# Altium schematic sheet power_unit.SchDoc
size 594 x 420 mm; Language: en; ResponsibleDept: DED; DocumentStatus: Released; DecimalNumber: {DecimalNumber}; ApprovedBy: Мельников; CheckedBy: Соколов; CompanyName: Диаконт; DrawnBy: Тихонов; DocumentNumber: ЭИТЦЯ.435131.005 Э3; SheetTotal: 1; Title0: Модуль силовой РМ; DocumentType: Схема электрическая принципиальная; Liter: Э; PageSetup: Record=PageOptions|CenterHorizontal=True|CenterVertical=True|PrintScale=0.96|XCorrection=1.00|YCorrection=1.00|PrintKind=1|BorderSize=5000000|LeftOffset=0|BottomOffset=0|Orientation=2|PaperLength=1000|PaperWidth=1000|Scale=100|PaperSource=7|PrintQuality=-4|MediaType=1|DitherType=10|PaperKind=A3|PrintScaleMode=1; FirstApp: ИТЦЯ.435131.005
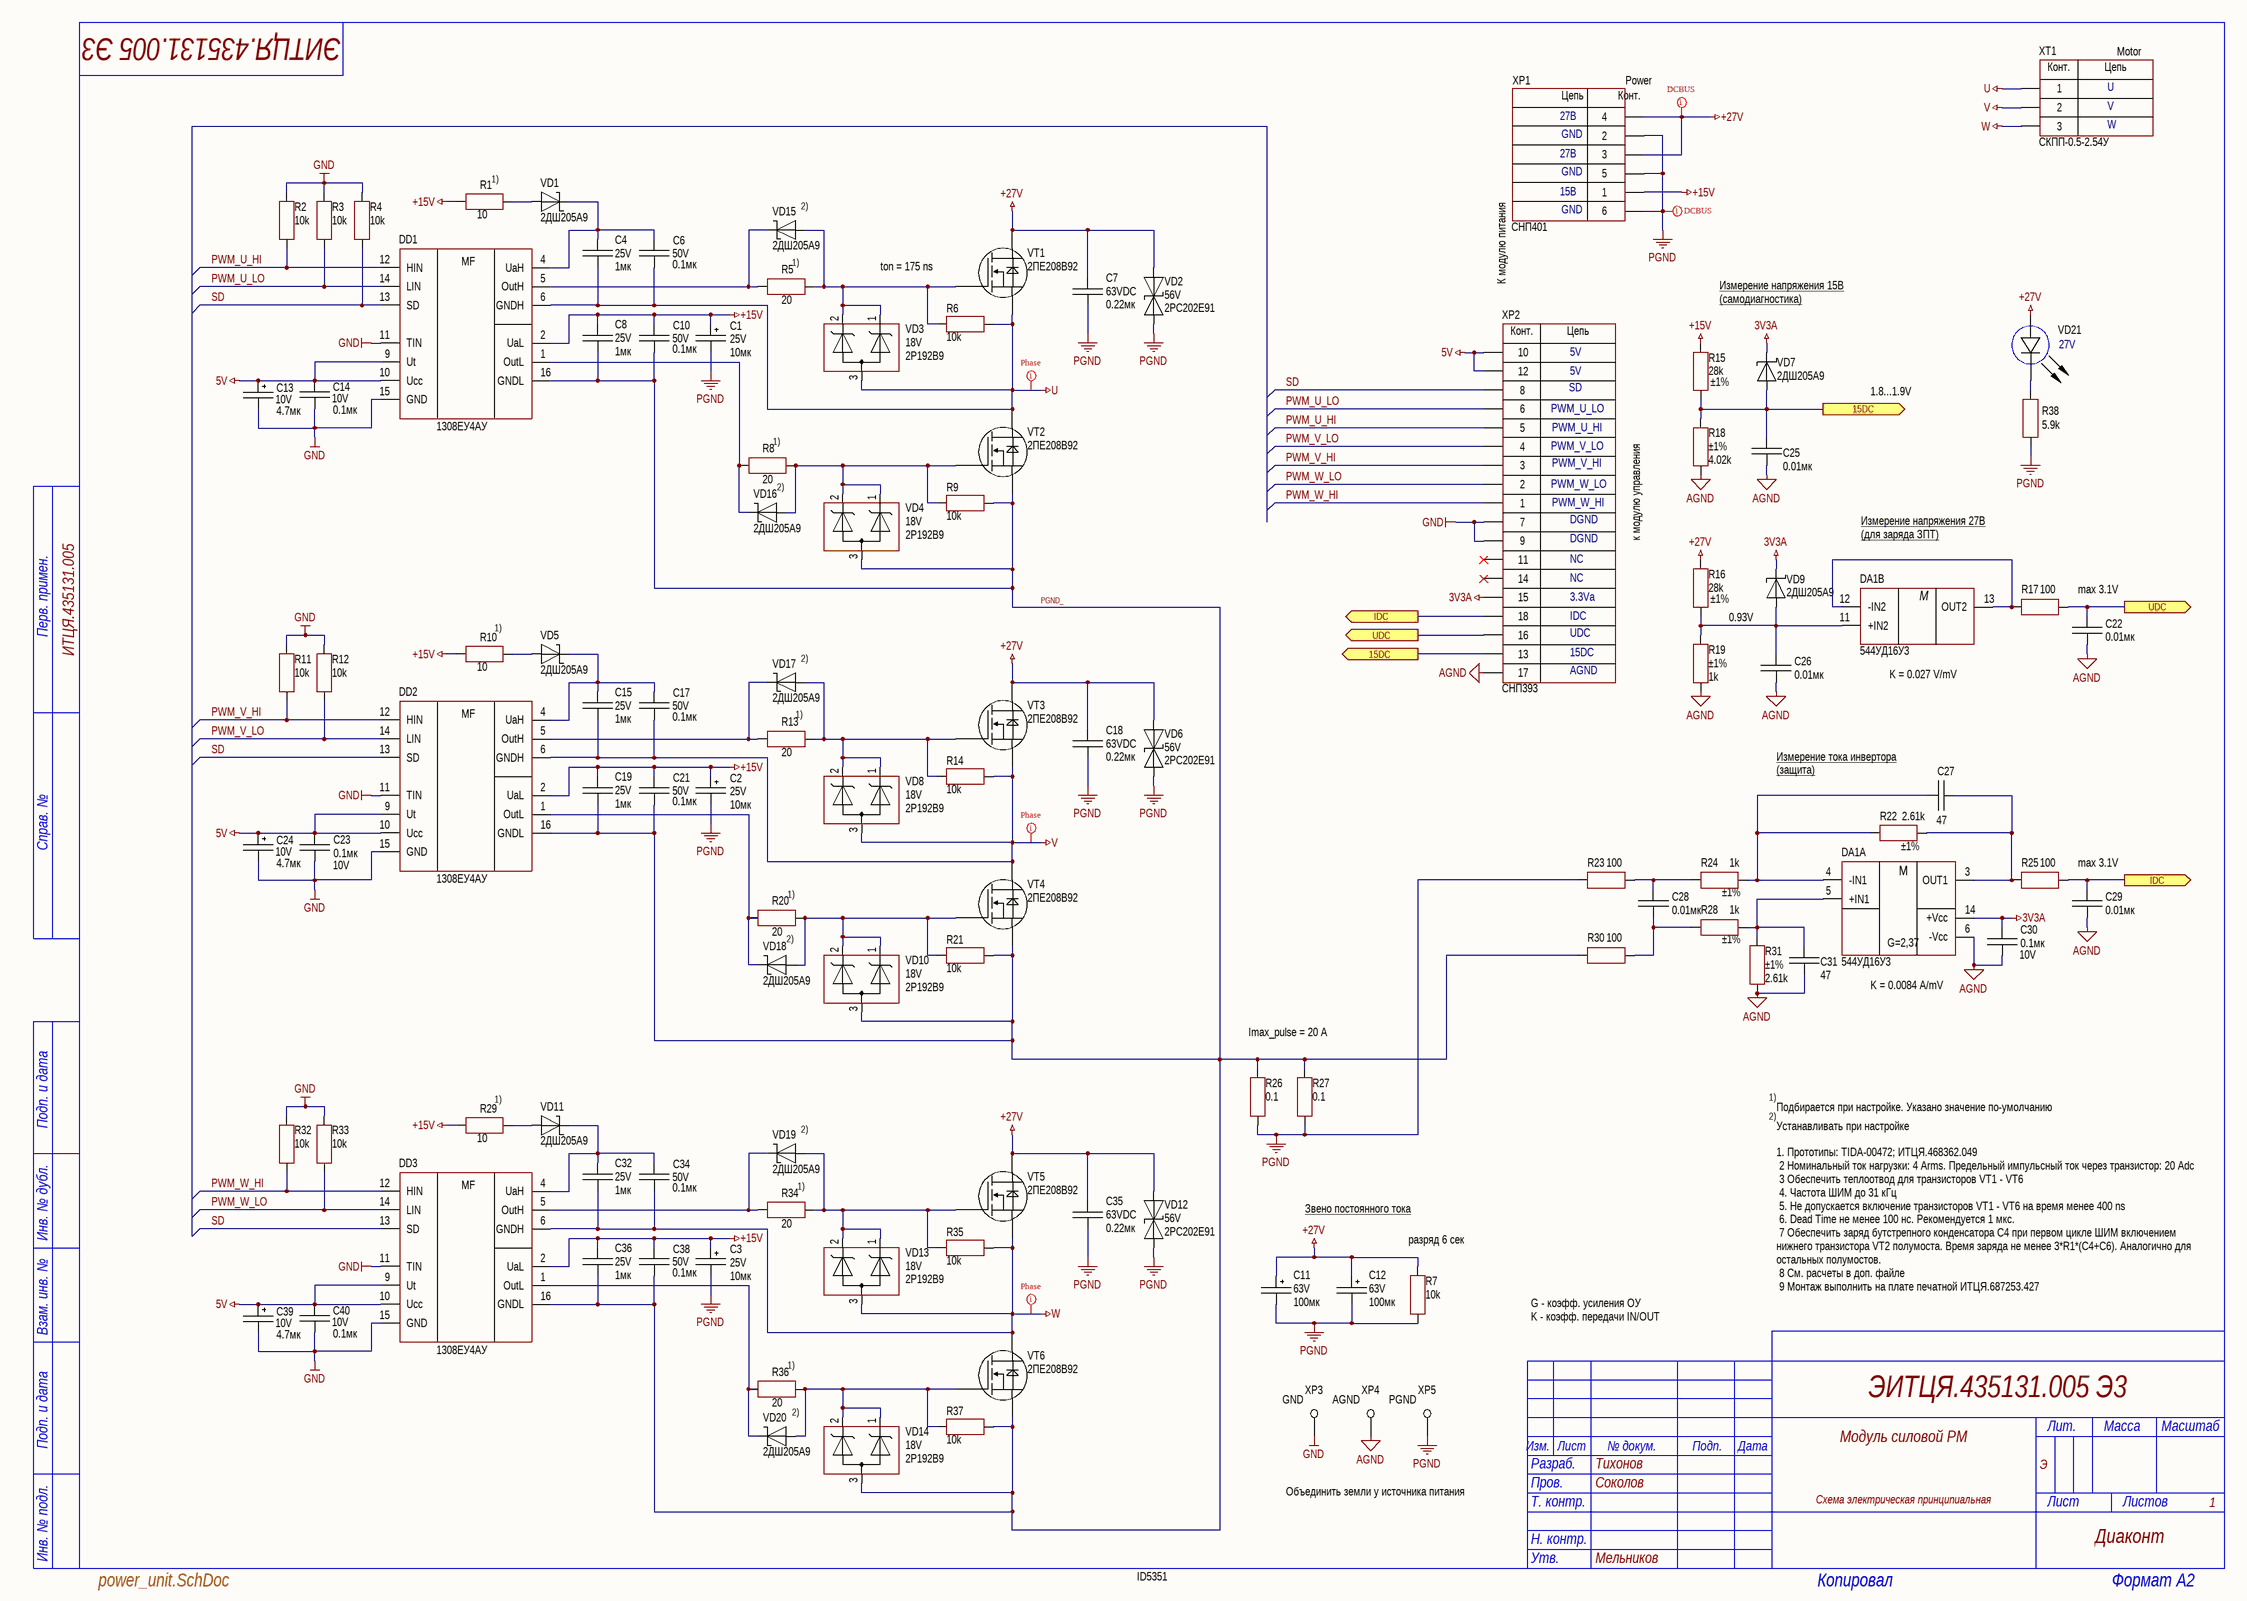
[diagram p0: power_unit.SchDoc]

## Parts
C1  value 10мк  Voltage: 25V  [CAP: TANTAL-C]
C2  value 10мк  Voltage: 25V  [CAP: TANTAL-C]
C3  value 10мк  Voltage: 25V  [CAP: TANTAL-C]
C4  value 1мк  Voltage: 25V  [CAP: 1210]
C6  value 0.1мк  Voltage: 50V  [CAP: 0805P]
C7  value 0.22мк  Voltage: 63VDC  [CAP: K73-17 12x10x6]
C8  value 1мк  Voltage: 25V  [CAP: 1210]
C10  value 0.1мк  Voltage: 50V  [CAP: 0805P]
C11  value 100мк  Voltage: 63V  [CAP: D8C3.5H12]
C12  value 100мк  Voltage: 63V  [CAP: D8C3.5H12]
C13  value 4.7мк  Voltage: 10V  [CAP: TANTAL-A]
C14  value 0.1мк  Voltage: 10V  [CAP: 0603P]
C15  value 1мк  Voltage: 25V  [CAP: 1210]
C17  value 0.1мк  Voltage: 50V  [CAP: 0805P]
C18  value 0.22мк  Voltage: 63VDC  [CAP: K73-17 12x10x6]
C19  value 1мк  Voltage: 25V  [CAP: 1210]
C21  value 0.1мк  Voltage: 50V  [CAP: 0805P]
C22  value 0.01мк  [CAP: 0603P]
C23  value 0.1мк  Voltage: 10V  [CAP: 0603P]
C24  value 4.7мк  Voltage: 10V  [CAP: TANTAL-A]
C25  value 0.01мк  [CAP: 0603P]
C26  value 0.01мк  [CAP: 0603P]
C27  value 47  [CAP: 0603P]
C28  value 0.01мк  [CAP: 0603P]
C29  value 0.01мк  [CAP: 0603P]
C30  value 0.1мк  Voltage: 10V  [CAP: 0603P]
C31  value 47  [CAP: 0603P]
C32  value 1мк  Voltage: 25V  [CAP: 1210]
C34  value 0.1мк  Voltage: 50V  [CAP: 0805P]
C35  value 0.22мк  Voltage: 63VDC  [CAP: K73-17 12x10x6]
C36  value 1мк  Voltage: 25V  [CAP: 1210]
C38  value 0.1мк  Voltage: 50V  [CAP: 0805P]
C39  value 4.7мк  Voltage: 10V  [CAP: TANTAL-A]
C40  value 0.1мк  Voltage: 10V  [CAP: 0603P]
DA1  Part_Number: 544УД16У3  [16-Н04.16-1B]  (hidden comment: 544УД16У3 (Н04.16-1В) АЕЯР.431130.510 ТУ_разнесенная 1)  (parts A,B of 2)
DD1  PartNumber: 1308ЕУ4АУ  [16-Н04.16-1B]
DD2  PartNumber: 1308ЕУ4АУ  [16-Н04.16-1B]
DD3  PartNumber: 1308ЕУ4АУ  [16-Н04.16-1B]
R1  value 10  [RES: 0603P]
R2  value 10k  [RES: 0603P]
R3  value 10k  [RES: 0603P]
R4  value 10k  [RES: 0603P]
R5  value 20  [RES: 0805P]
R6  value 10k  [RES: 0603P]
R7  value 10k  [RES: 0805P]
R8  value 20  [RES: 0805P]
R9  value 10k  [RES: 0603P]
R10  value 10  [RES: 0603P]
R11  value 10k  [RES: 0603P]
R12  value 10k  [RES: 0603P]
R13  value 20  [RES: 0805P]
R14  value 10k  [RES: 0603P]
R15  value 28k  Tolerance: ±1%  [RES: 0603P]
R16  value 28k  Tolerance: ±1%  [RES: 0603P]
R17  value 100  [RES: 0603P]
R18  value 4.02k  Tolerance: ±1%  [RES: 0603P]
R19  value 1k  Tolerance: ±1%  [RES: 0603P]
R20  value 20  [RES: 0805P]
R21  value 10k  [RES: 0603P]
R22  value 2.61k  Tolerance: ±1%  [RES: 0603P]
R23  value 100  [RES: 0603P]
R24  value 1k  Tolerance: ±1%  [RES: 0603P]
R25  value 100  [RES: 0603P]
R26  value 0.1  [RES: 2512]
R27  value 0.1  [RES: 2512]
R28  value 1k  Tolerance: ±1%  [RES: 0603P]
R29  value 10  [RES: 0603P]
R30  value 100  [RES: 0603P]
R31  value 2.61k  Tolerance: ±1%  [RES: 0603P]
R32  value 10k  [RES: 0603P]
R33  value 10k  [RES: 0603P]
R34  value 20  [RES: 0805P]
R35  value 10k  [RES: 0603P]
R36  value 20  [RES: 0805P]
R37  value 10k  [RES: 0603P]
R38  value 5.9k  [RES: 0805P]
VD1  PartNumber: 2ДШ205А9  [SOT23]
VD2  Voltage: 56V  PartNumber: 2РС202Е91  [DIODE: SMB]
VD3  Voltage: 18V  PartNumber: 2Р192В9  [SOT23]
VD4  Voltage: 18V  PartNumber: 2Р192В9  [SOT23]
VD5  PartNumber: 2ДШ205А9  [SOT23]
VD6  Voltage: 56V  PartNumber: 2РС202Е91  [DIODE: SMB]
VD7  PartNumber: 2ДШ205А9  [SOT23]
VD8  Voltage: 18V  PartNumber: 2Р192В9  [SOT23]
VD9  PartNumber: 2ДШ205А9  [SOT23]
VD10  Voltage: 18V  PartNumber: 2Р192В9  [SOT23]
VD11  PartNumber: 2ДШ205А9  [SOT23]
VD12  Voltage: 56V  PartNumber: 2РС202Е91  [DIODE: SMB]
VD13  Voltage: 18V  PartNumber: 2Р192В9  [SOT23]
VD14  Voltage: 18V  PartNumber: 2Р192В9  [SOT23]
VD15  PartNumber: 2ДШ205А9  [SOT23]
VD16  PartNumber: 2ДШ205А9  [SOT23]
VD17  PartNumber: 2ДШ205А9  [SOT23]
VD18  PartNumber: 2ДШ205А9  [SOT23]
VD19  PartNumber: 2ДШ205А9  [SOT23]
VD20  PartNumber: 2ДШ205А9  [SOT23]
VD21  CommentText: 27V  [LED: 0603G]
VT1  PartNumber: 2ПЕ208В92  [DPAK]
VT2  PartNumber: 2ПЕ208В92  [DPAK]
VT3  PartNumber: 2ПЕ208В92  [DPAK]
VT4  PartNumber: 2ПЕ208В92  [DPAK]
VT5  PartNumber: 2ПЕ208В92  [DPAK]
VT6  PartNumber: 2ПЕ208В92  [DPAK]
XP1  CommentText: СНП401  [CON: M80-5000605]  (hidden comment: Power)
XP2  CommentText: СНП393  [CON: PLD-18R]
XP3  AGND  [CON: PLS2-1]  (value not drawn)
XP4  AGND  [CON: PLS2-1]  (value not drawn)
XP5  AGND  [CON: PLS2-1]  (value not drawn)
XT1  CommentText: СКПП-0.5-2.54У  [CON: 233-403 WAGO]

## Ports
15DC (out), IDC (out), UDC (out)

## Nets
3V3A: C30.2 DA1.14(+Vcc) VD7.3(K) VD9.3(K) XP2.15
5V: C13.1 C14.2 C23.2 C24.1 C39.1 C40.2 DD1.9(Ut) DD1.10(Ucc) DD2.9(Ut) DD2.10(Ucc) DD3.9(Ut) DD3.10(Ucc) XP2.10 XP2.12
+15V: C1.1 C2.1 C3.1 C8.2 C10.2 C19.2 C21.2 C36.2 C38.2 DD1.2(UaL) DD2.2(UaL) DD3.2(UaL) R1.1 R10.1 R15.2 R29.1 XP1.1
+27V: C7.1 C11.1 C12.1 C18.1 C35.1 R7.2 R16.2 VD2.2(C) VD6.2(C) VD12.2(C) VD21.1(A) VT1.3(D) VT3.3(D) VT5.3(D) XP1.3 XP1.4
AGND: C22.2 C25.2 C26.2 C29.2 C30.1 C31.2 DA1.6(-Vcc) R18.1 R19.1 R31.1 XP2.17 XP4.1
GND: C13.2 C14.1 C23.1 C24.2 C39.2 C40.1 DD1.11(TIN) DD1.15(GND) DD2.11(TIN) DD2.15(GND) DD3.11(TIN) DD3.15(GND) R2.2 R3.2 R4.2 R11.2 R12.2 R32.2 R33.2 XP2.7 XP2.9 XP3.1
PGND: C1.2 C2.2 C3.2 C7.2 C11.2 C12.2 C18.2 C35.2 R7.1 R23.1 R26.2 R27.2 R38.1 VD2.1(A) VD6.1(A) VD12.1(A) XP1.2 XP1.5 XP1.6 XP5.1
U: C4.1 C6.1 DD1.6(GNDH) R6.1 VD3.3(A) VT1.2(S) VT2.3(D) XT1.1
V: C15.1 C17.1 DD2.6(GNDH) R14.1 VD8.3(A) VT3.2(S) VT4.3(D) XT1.2
W: C32.1 C34.1 DD3.6(GNDH) R35.1 VD13.3(A) VT5.2(S) VT6.3(D) XT1.3
15DC: C25.1 R15.1 R18.2 VD7.1(A) XP2.13 ; port 15DC
IDC: C29.1 R25.2 XP2.18 ; port IDC
PGND_: C8.1 C10.1 C19.1 C21.1 C36.1 C38.1 DD1.16(GNDL) DD2.16(GNDL) DD3.16(GNDL) R9.1 R21.1 R26.1 R27.1 R30.1 R37.1 VD4.3(A) VD10.3(A) VD14.3(A) VT2.2(S) VT4.2(S) VT6.2(S)
PWM_U_HI: DD1.12(HIN) R2.1 XP2.5
PWM_U_LO: DD1.14(LIN) R3.1 XP2.6
PWM_V_HI: DD2.12(HIN) R11.1 XP2.3
PWM_V_LO: DD2.14(LIN) R12.1 XP2.4
PWM_W_HI: DD3.12(HIN) R32.1 XP2.1
PWM_W_LO: DD3.14(LIN) R33.1 XP2.2
SD: DD1.13(SD) DD2.13(SD) DD3.13(SD) R4.1 XP2.8
UDC: C22.1 R17.2 XP2.16 ; port UDC
NetC4_2: C4.2 C6.2 DD1.4(UaH) VD1.3(K)
NetC15_2: C15.2 C17.2 DD2.4(UaH) VD5.3(K)
NetC26_1: C26.1 DA1.11(+IN2) R16.1 R19.2 VD9.1(A)
NetC27_1: C27.1 DA1.3(OUT1) R22.2 R25.1
NetC27_2: C27.2 DA1.4(-IN1) R22.1 R24.2
NetC28_1: C28.1 R23.2 R24.1
NetC28_2: C28.2 R28.1 R30.2
NetC31_1: C31.1 DA1.5(+IN1) R28.2 R31.2
NetC32_2: C32.2 C34.2 DD3.4(UaH) VD11.3(K)
NetDA1_12: DA1.12(-IN2) DA1.13(OUT2) R17.1
NetDD1_1: DD1.1(OutL) R8.1 VD16.3(K)
NetDD1_5: DD1.5(OutH) R5.1 VD15.3(K)
NetDD2_1: DD2.1(OutL) R20.1 VD18.3(K)
NetDD2_5: DD2.5(OutH) R13.1 VD17.3(K)
NetDD3_1: DD3.1(OutL) R36.1 VD20.3(K)
NetDD3_5: DD3.5(OutH) R34.1 VD19.3(K)
NetR1_2: R1.2 VD1.1(A)
NetR5_2: R5.2 R6.2 VD3.1(K1) VD3.2(K2) VD15.1(A) VT1.1(G)
NetR8_2: R8.2 R9.2 VD4.1(K1) VD4.2(K2) VD16.1(A) VT2.1(G)
NetR10_2: R10.2 VD5.1(A)
NetR13_2: R13.2 R14.2 VD8.1(K1) VD8.2(K2) VD17.1(A) VT3.1(G)
NetR20_2: R20.2 R21.2 VD10.1(K1) VD10.2(K2) VD18.1(A) VT4.1(G)
NetR29_2: R29.2 VD11.1(A)
NetR34_2: R34.2 R35.2 VD13.1(K1) VD13.2(K2) VD19.1(A) VT5.1(G)
NetR36_2: R36.2 R37.2 VD14.1(K1) VD14.2(K2) VD20.1(A) VT6.1(G)
NetR38_2: R38.2 VD21.2(C)

Not connected (* = marked no-connect by the designer): DA1 1(NC) 2(NC) 7(NC) 8(NC) 9(NC) 10(NC) 15(NC) 16(NC); XP2 11* 14*

## Layout directives
net class DCBUS: +27V, PGND
net class MotorPhases: U, V, W

## Notes on the sheet
- Motor
- 27В
- (near XP1) Power
- U
- V
- GND
- W
- (near R1) 1)
- (near VD15) 2)
- К модулю питания
- 15В
- 1)
- (near VT1) ton = 175 ns
- Измерение напряжения 15В
  (самодиагностика)
- 5V
- SD
- 1.8...1.9V
- (near R8) 1)
- PWM_U_LO
- PWM_V_LO
- PWM_U_HI
- 2)
- PWM_W_LO
- PWM_V_HI
- PWM_W_HI
- DGND
- к модулю управления
- Измерение напряжения 27В
  (для заряда ЗПТ)
- 3.3Va
- NC
- max 3.1V
- (near R10) 1)
- IDC
- UDC
- 0.93V
- (near VD17) 2)
- 15DC
- AGND
- K = 0.027 V/mV
- (near C27) Измерение тока инвертора
  (защита)
- (near R20) 1)
- (near DA1) G=2,37
- K = 0.0084 A/mV
- Imax_pulse = 20 A
- (near R29) 1)
- Подбирается при настройке. Указано значение по-умолчанию
- (near VD19) 2)
- Устанавливать при настройке
- (near R34) 1)
- Звено постоянного тока
- (near R7) разряд 6 сек
- G - коэфф. усиления ОУ
  K - коэфф. передачи IN/OUT
- 1. Прототипы: TIDA-00472; ИТЦЯ.468362.049
  2 Номинальный ток нагрузки: 4 Arms. Предельный импульсный ток через транзистор: 20 Аdc
  3 Обеспечить теплоотвод для транзисторов VT1 - VT6
  4. Частота ШИМ до 31 кГц
  5. Не допускается включение транзисторов VT1 - VT6 на время менее 400 ns
  6. Dead Time не менее 100 нс. Рекомендуется 1 мкс.
  7 Обеспечить заряд бутстрепного конденсатора С4 при первом цикле ШИМ включением нижнего транзистора VT2 полумоста. Время заряда не менее 3*R1*(C4+С6). Аналогично для остальных полумостов.
  8 См. расчеты в доп. файле
  9 Монтаж выполнить на плате печатной ИТЦЯ.687253.427
- (near R36) 1)
- (near XP3) GND
- (near XP4) AGND
- (near XP5) PGND
- Объединить земли у источника питания
- ID5351
- Перв. примен.
- Справ. №
- Подп. и дата
- Инв. № дубл.
- Взам. инв. №
- Изм.
- Лист
- № докум.
- Подп.
- Дата
- Лит.
- Масса
- Масштаб
- Разраб.
- Пров.
- Т. контр.
- Листов
- Инв. № подл.
- Н. контр.
- Утв.
- Копировал
- Формат A2
- (in symbol 544УД16У3 (Н04.16-1В) АЕЯР.431130.510 ТУ_разнесенная 1, part A) M
- (in symbol 544УД16У3 (Н04.16-1В) АЕЯР.431130.510 ТУ_разнесенная 1, part B) M
- (in symbol 1308ЕУ4БУ) MF
- (in symbol Connector_terminal_3pin) Конт.; Цепь
- (in symbol M80-5000605 Harwin) Цепь; Конт.
- (in symbol PLD-18) Конт.; Цепь

## Library data of the parts
C1-C3 = Tantal_C: Manufacturer: Элеконд; PartNumber: К53-68 "С"-25 В-10 мкф ±10%; ValueManufacturerPartNumber: Tantalum capacitor, 10мк, 25V, ±10%, 0.8-1Ohm, case C (6032), -60...+125°C; Impedance: 0.8-1Ohm; Tolerance: ±10%; TypeDielectric: X7R; TypeCapacitor: Tantalum capacitor; Package: case C (6032); HelpURL: https://eandc.ru/pdf/kondensator/k53-68.pdf; Temperature: -60...+125°C
C4 C8 C15 C19 C32 C36 = Ceramic_1210: Manufacturer: Monolit; PartNumber: К10-84в-3225М-25~В-Н20-1 мкФ-O-A ±10% ФЦТА.673516.016 ТУ; ValueManufacturerPartNumber: Ceramic capacitor, 1мк, Н20 (X7R), ±10%, 25V, 1210, -55...+125°C; TypeCapacitor: Ceramic capacitor; Tolerance: ±10%; TypeDielectric: Н20 (X7R); Package: 1210; HelpURL: http://monolit.vitebsk.by/products/kondensatory/K1084NOVYE/; Temperature: -55...+125°C
C6 C10 C17 C21 C34 C38 = Ceramic_0805: Manufacturer: Монолит; PartNumber: К10-84в-2012М-50В-0,1 мкФ +80/-20%-Н90-N-A; ValueManufacturerPartNumber: Ceramic capacitor, 0.1мк, Н90 (Y5V), +80 -20%, 50V, 0805 (2012), -55...+125°C; TypeCapacitor: Ceramic capacitor; Tolerance: +80 -20%; TypeDielectric: Н90 (Y5V); Analog: 00131672 (pin-to-pin); Package: 0805 (2012); HelpURL: http://monolit.vitebsk.by/products/kondensatory/K1084NOVYE/; Temperature: -55...+125°C
C7 C18 C35 = Film: Manufacturer: Гириконд; PartNumber: K73-17-63В-0,22мкФ±10%-В АЖЯР.673633.004 ТУ; TypeCapacitor: Film capacitor; Tolerance: ±10%; Package: 12x10 mm; HelpURL: http://www.giricond.ru/files/k73-17_.pdf; ValueManufacturerPartNumber: =TypeCapacitor+', '+Value+', '+Voltage+', '+Tolerance+', '+Impedance+', '+Package+', '+Temperature; Temperature: -60...+125°C
C11 C12 = Aluminium: Manufacturer: Элеконд; PartNumber: K50-93-63В-100мкФ ±20% -И-В АЖЯР.673541.021 ТУ; ValueManufacturerPartNumber: Aluminium capacitor, 100мк, 63V, ±20%, 0.342Ohm@100kHz, 8x11.3x3.5 mm, -60...+100°C; TypeCapacitor: Aluminium capacitor; Tolerance: ±20%; Impedance: 0.342Ohm@100kHz; MAX: 00139211; Package: 8x11.3x3.5 mm; HelpURL: https://elecond.ru/production/capacitors/aluminum/k50-93; Temperature: -60...+100°C
C13 C24 C39 = Tantal_A: Manufacturer: Элеконд; PartNumber: К53-68 "А"-10 В-4.7 мкф; ValueManufacturerPartNumber: Tantalum capacitor, 4.7мк, 10V, ±10%, 2Ohm, case A (3216), -55...+125°C; Impedance: 2Ohm; Tolerance: ±10%; TypeDielectric: X7R; TypeCapacitor: Tantalum capacitor; MAX: 00130629; Package: case A (3216); HelpURL: https://www.digikey.com/product-detail/en/avx-corporation/F930J107KAAAJ6/478-12404-1-ND/9645231; Temperature: -55...+125°C
C14 C40 = Ceramic_0603: Manufacturer: Гириконд; PartNumber: К10-79-10В-0,1 мкФ +80-20% H90; ValueManufacturerPartNumber: Ceramic capacitor, 0.1мк, H90, +80-20%, 10V, 0603, -55...+125°C; TypeCapacitor: Ceramic capacitor; Tolerance: +80-20%; TypeDielectric: H90; MAX: 00131675; Package: 0603; HelpURL: http://www.giricond.ru/files/k10-79_vp_2018_saiyt.pdf; Temperature: -55...+125°C
C22 C26 C28 C29 = Ceramic_0603: Manufacturer: Монолит; PartNumber: К10-84в-1608М-50В-0.01мк ±20%-Н20-N-A; ValueManufacturerPartNumber: Ceramic capacitor, 0.01мк, H20, ±20%, 50V, 0603, -55...+125°C; TypeCapacitor: Ceramic capacitor; Tolerance: ±20%; TypeDielectric: H20; Voltage: 50V; Analog: MAX 00131676 (pin-to-pin); Package: 0603; HelpURL: http://www.monolit.vitebsk.by/Files/K10-84.pdf; Temperature: -55...+125°C
C23 C30 = Ceramic_0603: Manufacturer: Гириконд; PartNumber: К10-79-10В-0,1 мкФ +80-20% H90; ValueManufacturerPartNumber: Ceramic capacitor, 0.1мк, H90, +80-20%, 10V, 0603, -55...+125°C; TypeCapacitor: Ceramic capacitor; Tolerance: +80-20%; TypeDielectric: H90; Package: 0603; HelpURL: http://www.giricond.ru/files/k10-79_vp_2018_saiyt.pdf; Temperature: -55...+125°C
C25 = Ceramic_0603: Manufacturer: Монолит; PartNumber: К10-84в-1608М-50В-0.01мк ±20%-Н20-N-A; ValueManufacturerPartNumber: Ceramic capacitor, 0.01мк, H20, ±20%, 50V, 0603, -55...+125°C; TypeCapacitor: Ceramic capacitor; Tolerance: ±20%; TypeDielectric: H20; Voltage: 50V; Analog: MAX 00132726 (pin-to-pin); Package: 0603; HelpURL: http://www.monolit.vitebsk.by/Files/K10-84.pdf; Temperature: -55...+125°C
C27 C31 = Ceramic_0603: Manufacturer: Монолит; PartNumber: К10-84в-1608М-50В-47 пФ ±10%-МП0-N-A; ValueManufacturerPartNumber: Ceramic capacitor, 47, МП0, ±10%, 50V, 0603, -55...+125°C; TypeCapacitor: Ceramic capacitor; Tolerance: ±10%; TypeDielectric: МП0; Voltage: 50V; Analog: 00124425 (pin-to-pin); Package: 0603; HelpURL: http://monolit.vitebsk.by/products/kondensatory/K1047Mabv/; Temperature: -55...+125°C
DA1 = 544УД16У3 (Н04.16-1В) АЕЯР.431130.510 ТУ_разнесенная 1: Op. Amp rail-to-rail; Manufacturer: НПП "Восток"; MAX: 00130727; Analog-1: функц. аналог OP284FS; Analog: КУД16У31436 (ОТК) НПП "Восток"; TU: АЕЯР.431130.510 ТУ; Pattern/Footprint: 16-Н04.16-1B; Publisher: Sokolov; Published: 2019; HelpURL: http://www.vostok.nsk.su/files/pdf/544UD16U3.pdf; Type: Операционный усилитель
DD1-DD3 = 1308ЕУ4БУ: Gate driver; Manufacturer: Кремний Эл; VoltageSupply: supply 4...15V; CurrentOutput: 2A; Analog: IR2113 IR; MAX: 00131005; HelpURL: http://caxapa.ru/parts/files/1SHKtJ3.pdf; Package: Н04.16-2В; ComponentType: Hight&Low side gate driver; ValueManufacturerPartNumber: =ComponentType+', '+VoltageWork+', '+Frequency+', '+CurrentOutput+', '+VoltageSupply+', '+Temperature+', '+Package
R1 R10 R29 = Resistor_0603: Manufacturer: ОАО Ресурс; PartNumber: Р1-12-0,1ум.-10~Ом ±2%-М ШКАБ.434110.002 ТУ; ValueManufacturerPartNumber: Resistor film, 10, ±5%, 0603, 0.1W, -55...+125°C; TypeResistor: Resistor film; Power: 0.1W; Tolerance: ±5%; MAX: 00133989; Package: 0603; HelpURL: https://aoresurs.com/catalog/chip_rezistory/rezistory-r1-12-kategoriya-kachestva-vp-/; Temperature: -55...+125°C
R2-R4 R6 R9 R11 R12 R14 R21 R32 R33 R35 R37 = Resistor_0603: Manufacturer: ОАО Ресурс; PartNumber: Р1-12-0,1ум.-10~кОм ±5%-М ШКАБ.434110.002 ТУ; ValueManufacturerPartNumber: Resistor film, 10k, ±5%, 0603, 0.1W, -55...+125°C; TypeResistor: Resistor film; Power: 0.1W; Tolerance: ±5%; MAX: 00133985; Analog: MAX 00133986 (1%); Package: 0603; HelpURL: https://aoresurs.com/catalog/chip_rezistory/rezistory-r1-12-kategoriya-kachestva-vp-/; Temperature: -55...+125°C
R5 R8 R13 R20 R34 R36 = Resistor_0805: Manufacturer: ОАО Ресурс; PartNumber: Р1-12-0,125-20 Ом ±1%-М ШКАБ.434110.002 ТУ; ValueManufacturerPartNumber: Resistor film, 20, ±1%, 0805, 0.125W, -55...+125°C; TypeResistor: Resistor film; Power: 0.125W; Tolerance: ±1%; Analog: MAX 00133867 (22Ом); MAX: 00133863; Package: 0805; HelpURL: https://aoresurs.com/catalog/chip_rezistory/rezistory-r1-12-kategoriya-kachestva-vp-/; Temperature: -55...+125°C
R7 = Resistor_0603: Manufacturer: ОАО Ресурс; PartNumber: Р1-12-0,125-10~кОм ±1%-М ШКАБ.434110.002 ТУ; ValueManufacturerPartNumber: Resistor film, 10k, ±1%, 0805, 0.125W, -55...+125°C; TypeResistor: Resistor film; Power: 0.125W; Tolerance: ±1%; MAX: 00133985; Package: 0805; HelpURL: https://aoresurs.com/catalog/chip_rezistory/rezistory-r1-12-kategoriya-kachestva-vp-/; Temperature: -55...+125°C
R15 R16 = Resistor_0603: Manufacturer: ОАО Ресурс; PartNumber: Р1-12-0,1ум.-28~кОм ±5%-М ШКАБ.434110.002 ТУ; ValueManufacturerPartNumber: Resistor film, 28k, ±1%, 0603, 0.1W, -55...+125°C; TypeResistor: Resistor film; Power: 0.1W; MAX: 00134035; Package: 0603; HelpURL: https://aoresurs.com/catalog/chip_rezistory/rezistory-r1-12-kategoriya-kachestva-vp-/; Temperature: -55...+125°C
R17 R23 R25 R30 = Resistor_0603: Manufacturer: ОАО Ресурс; PartNumber: Р1-12-0,1ум.-100~Ом ±5%-М ШКАБ.434110.002 ТУ; ValueManufacturerPartNumber: Resistor film, 100, ±5%, 0603, 0.1W, -55...+125°C; TypeResistor: Resistor film; Power: 0.1W; Tolerance: ±5%; MAX: 00133991; Package: 0603; HelpURL: https://aoresurs.com/catalog/chip_rezistory/rezistory-r1-12-kategoriya-kachestva-vp-/; Temperature: -55...+125°C
R18 = Resistor_0603: Manufacturer: ОАО Ресурс; PartNumber: Р1-12-0,1ум.-4.02~кОм±1%-М ШКАБ.434110.002 ТУ; ValueManufacturerPartNumber: Resistor film, 4.02k, ±1%, 0603, 0.1W, -55...+125°C; TypeResistor: Resistor film; Power: 0.1W; MAX: 00134054; Package: 0603; HelpURL: https://aoresurs.com/catalog/chip_rezistory/rezistory-r1-12-kategoriya-kachestva-vp-/; Temperature: -55...+125°C
R19 R24 R28 = Resistor_0603: Manufacturer: ОАО Ресурс; PartNumber: Р1-12-0,1ум.-1~кОм ±1%-М ШКАБ.434110.002 ТУ; ValueManufacturerPartNumber: Resistor film, 1k, ±1%, 0603, 0.1W, -55...+125°C; TypeResistor: Resistor film; Power: 0.1W; MAX: 00133971; Package: 0603; HelpURL: https://aoresurs.com/catalog/chip_rezistory/rezistory-r1-12-kategoriya-kachestva-vp-/; Temperature: -55...+125°C
R22 R31 = Resistor_0603: Manufacturer: ОАО Ресурс; PartNumber: Р1-12-0,1ум.-2.61~кОм±1%-М ШКАБ.434110.002 ТУ; ValueManufacturerPartNumber: Resistor film, 2.61k, ±1%, 0603, 0.1W, -55...+125°C; TypeResistor: Resistor film; Power: 0.1W; MAX: 00134019; Package: 0603; HelpURL: https://aoresurs.com/catalog/chip_rezistory/rezistory-r1-12-kategoriya-kachestva-vp-/; Temperature: -55...+125°C
R26 R27 = Resistor_2512: Manufacturer: Эркон; PartNumber: Р2-105-0,75-0,1 Ом±1% А РМУ.434150.001 ТУ; ValueManufacturerPartNumber: Resistor film, 0.1, ±1%, 2512, 0.75W, -55...+125°C; TypeResistor: Resistor film; Power: 0.75W; Tolerance: ±1%; MAX: 00149850; Package: 2512; HelpURL: https://www.erkon-nn.ru/catalog/15/r2-105/; Temperature: -55...+125°C
R38 = Resistor_0603: Manufacturer: ОАО Ресурс; PartNumber: Р1-12-0,1-5.9~кОм ±5%-М ШКАБ.434110.002 ТУ; ValueManufacturerPartNumber: Resistor film, 5.9k, ±5%, 0805, 0.1W, -55...+125°C; TypeResistor: Resistor film; Power: 0.1W; Tolerance: ±5%; MAX: 00134499; Package: 0805; HelpURL: https://aoresurs.com/catalog/chip_rezistory/rezistory-r1-12-kategoriya-kachestva-vp-/; Temperature: -55...+125°C
VD1 VD5 VD7 VD9 VD11 VD15-VD20 = 2ДШ205А9_SOT-23: Manufacturer: ВЗПП Воронеж; ValueManufacturerPartNumber: shottki diode, 80V, 500mA; max 5 A@1ms, 0.8V, <22ns, SOT-23, -55...+150°C; TypeDiode: shottki diode; Voltage: 80V; Current: 500mA; max 5 A@1ms; VoltageDrop: 0.8V; RecoveryTime: <22ns; Analog: MBR0580; Package: SOT-23; Temperature: -55...+150°C
VD2 VD6 VD12 = TVS_single: Manufacturer: ВЗПП; TypeDiode: Zener diode; Current: 8A; VoltageDrop: 0.9V; Analog: SMBJ48CA (pin-to-pin); Package: SMB; HelpURL: http://www.nzpp.ru/product/; ValueManufacturerPartNumber: =TypeDiode+', '+Voltage+', '+Current+', '+VoltageDrop+', '+RecoveryTime+', '+Package+', '+Temperature; Temperature: -55...+150°C
VD3 VD4 VD8 VD10 VD13 VD14 = TVS_array_var2: Manufacturer: КРИП; TypeDiode: TVS diode; Current: 1A; Uогр.: 22.5V; Cap: 21pF; NOTE: указано для pin1-pin3; Analog: КР192А9 (ОТК) (pin-to-pin); Package: SOT-23; ValueManufacturerPartNumber: =TypeDiode+', '+Voltage+', '+Current+', '+VoltageDrop+', '+RecoveryTime+', '+Package+', '+Temperature; Temperature: -55...+150°C
VD21 = LED_single: Manufacturer: Протон; ValueManufacturerPartNumber: LED, 20mA max, 1.9V@4mA, 1608, -55...+150°C; PartNumber: ИПД169А9-Л; TypeDiode: LED; Current: 20mA max; VoltageDrop: 1.9V@4mA; Color: GREEN; Analog: MAX 00129484 КР-1608 Kingbright (pin-to-pin); Package: 1608; HelpURL: *; Temperature: -55...+150°C
VT1-VT6 = 2ПЕ208В92_N_DPAK: Ангстрем (ВП); ValueManufacturerPartNumber: MOSFET N-channel transistor, 100V, 32A@+25°C, 59nC, 2.5W, 45mOhm, 3200pF, DPAK (KT-89), -55...+150°C; TypeTransistor: MOSFET N-channel transistor; VoltageDS: 100V; CurrentDS: 32A@+25°C; RDS: 45mOhm; GateCharge: 59nC; InputCapacitor: 3200pF; MaxPower: 2.5W; Analog: AnD28N10; Manufacturer: Ангстрем; Package: DPAK (KT-89); HelpURL: https://angstrem.ru/ru/and28n10; Temperature: -55...+150°C
XP1 = M80-5000605 Harwin: вилка на плату; Manufacturer: Электродеталь; ValueManufacturerPartNumber: Вилка, 6pin, 2mm, 120VAC, 1.5A; PartNumber: СНП401-6ВП21-3-1-1; VoltageMax: 120VAC; Pitch: 2mm; CurrentMax: 1.5A; Multichannel: 6pin; Analog: MAX 00126397 (M80-5000605 pin-to-pin); HelpURL: https://eu.mouser.com/ProductDetail/Harwin/M80-5000605?qs=yQtJ9TWM%2F1KaJIUUBEXorg%3D%3D; TypeConnector: Вилка
XP2 = PLD-18: Manufacturer: Электродеталь; ValueManufacturerPartNumber: Connector, 18pin, 2.54mm, 500VAC, 3A; PartNumber: СНП393-18ВП31-2-01-5 РЮМК.430420.035 ТУ; TypeConnector: Connector; VoltageMax: 500VAC; Pitch: 2.54mm; CurrentMax: 3A; Multichannel: 18pin; Analog: MAX 000724477 (PLD-80R с доработкой до 18pin)
XP3-XP5 = PLS2-1: Test probe; PartNumber: СНП377-1ВП21-1; Manufacturer: Электродеталь; Tolerance: СНП377; MAX: 00130069; Шаг: 2mm; Analog: PLS2-1; MAX: *; Publisher: TEN; Published: 2019; Type: Control pin; HelpURL: https://www.elektrodetal.com/catalog/snp377/
XT1 = Connector_terminal_3pin: Manufacturer: Завод Атлант; ValueManufacturerPartNumber: Terminal connector, 3pin, 3.5mm, 300VAC, 6A; PartNumber: СКПП-0.5-2.54У-3x2-2 СЦНК.434410.044 ТУ; TypeConnector: Terminal connector; VoltageMax: 300VAC; Pitch: 3.5mm; CurrentMax: 6A; Multichannel: 3pin; Analog: 233-403 Wago; HelpURL: http://xn--80aaagkp6are6bd.xn--p1ai/main/soediniteli_klemmnye/klemmy_dlja_pechatnogo_montazha/skpp_05_254u_1(24)h2_2(3)